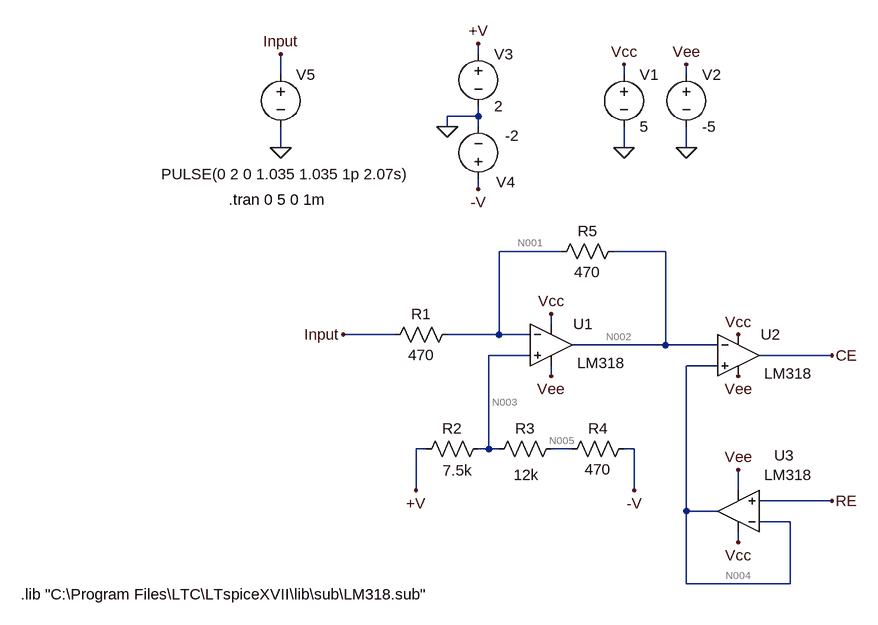
[diagram p0: schematic Offset.asc]
Offset.asc, the LTspice schematic file:
Version 4
SHEET 1 2136 1220
WIRE 256 -144 256 -160
WIRE -48 -112 -48 -144
WIRE 480 -112 480 -128
WIRE 576 -112 576 -128
WIRE 256 -48 256 -64
WIRE 256 -48 208 -48
WIRE 208 -32 208 -48
WIRE 256 -32 256 -48
WIRE -48 0 -48 -32
WIRE 480 0 480 -32
WIRE 576 0 576 -32
WIRE 256 64 256 48
WIRE 384 160 288 160
WIRE 544 160 464 160
WIRE 368 272 368 256
WIRE 128 288 48 288
WIRE 288 288 288 160
WIRE 288 288 208 288
WIRE 336 288 288 288
WIRE 544 304 544 160
WIRE 544 304 400 304
WIRE 624 304 544 304
WIRE 336 320 272 320
WIRE 800 320 688 320
WIRE 624 336 576 336
WIRE 368 352 368 336
WIRE 176 464 160 464
WIRE 272 464 272 320
WIRE 272 464 256 464
WIRE 288 464 272 464
WIRE 400 464 368 464
WIRE 496 464 480 464
WIRE 160 528 160 464
WIRE 496 528 496 464
WIRE 656 528 656 496
WIRE 800 544 688 544
WIRE 576 560 576 336
WIRE 624 560 576 560
WIRE 736 576 688 576
WIRE 656 608 656 592
WIRE 576 672 576 560
WIRE 736 672 736 576
WIRE 736 672 576 672
FLAG 480 -128 Vcc
FLAG 368 256 Vcc
FLAG 368 352 Vee
FLAG 576 -128 Vee
FLAG 256 -160 +V
FLAG 160 528 +V
FLAG 256 64 -V
FLAG 496 528 -V
FLAG -48 -144 Input
FLAG 48 288 Input
FLAG -48 0 0
FLAG 480 0 0
FLAG 576 0 0
FLAG 208 -32 0
FLAG 800 320 CE
FLAG 656 352 Vee
FLAG 656 496 Vee
FLAG 656 288 Vcc
FLAG 656 608 Vcc
FLAG 800 544 RE
SYMBOL res 160 480 R270
WINDOW 0 32 56 VTop 2
WINDOW 3 -33 64 VTop 2
SYMATTR InstName R2
SYMATTR Value 7.5k
SYMBOL res 224 272 R90
WINDOW 0 0 56 VBottom 2
WINDOW 3 32 56 VTop 2
SYMATTR InstName R1
SYMATTR Value 470
SYMBOL res 480 144 R90
WINDOW 0 0 56 VBottom 2
WINDOW 3 32 56 VTop 2
SYMATTR InstName R5
SYMATTR Value 470
SYMBOL OpAmps\\opamp2 368 240 R0
WINDOW 0 34 32 Left 2
WINDOW 3 40 92 Left 2
SYMATTR InstName U1
SYMATTR Value LM318
SYMBOL voltage 480 -128 R0
WINDOW 123 0 0 Left 0
WINDOW 39 0 0 Left 0
SYMATTR InstName V1
SYMATTR Value 5
SYMBOL voltage 576 -128 R0
WINDOW 123 0 0 Left 0
WINDOW 39 0 0 Left 0
SYMATTR InstName V2
SYMATTR Value -5
SYMBOL voltage 256 -160 R0
WINDOW 123 0 0 Left 0
WINDOW 39 0 0 Left 0
SYMATTR InstName V3
SYMATTR Value 2
SYMBOL voltage 256 64 R180
WINDOW 0 -57 11 Left 2
WINDOW 3 -63 82 Left 2
WINDOW 123 0 0 Left 0
WINDOW 39 0 0 Left 0
SYMATTR InstName V4
SYMATTR Value -2
SYMBOL voltage -48 -128 R0
WINDOW 123 0 0 Left 0
WINDOW 39 0 0 Left 0
WINDOW 3 -184 169 Left 2
SYMATTR Value PULSE(0 2 0 1.035 1.035 1p 2.07s)
SYMATTR InstName V5
SYMBOL res 272 480 R270
WINDOW 0 32 56 VTop 2
WINDOW 3 -8 58 VBottom 2
SYMATTR InstName R3
SYMATTR Value 12k
SYMBOL res 496 448 R90
WINDOW 0 0 56 VBottom 2
WINDOW 3 32 56 VTop 2
SYMATTR InstName R4
SYMATTR Value 470
SYMBOL OpAmps\\opamp2 656 256 R0
WINDOW 0 34 32 Left 2
WINDOW 3 40 92 Left 2
SYMATTR InstName U2
SYMATTR Value LM318
SYMBOL OpAmps\\opamp2 656 624 R180
WINDOW 0 -86 150 Left 2
WINDOW 3 -114 120 Left 2
SYMATTR InstName U3
SYMATTR Value LM318
TEXT -448 688 Left 2 !.lib "C:\\Program Files\\LTC\\LTspiceXVII\\lib\\sub\\LM318.sub"
TEXT -128 80 Left 2 !.tran 0 5 0 1m

The netlist it stands for:
* Offset.asc
R2 +V N003 7.5k
R1 N001 Input 470
R5 N002 N001 470
XU1 N003 N001 Vcc Vee N002 LM318  ; pins In+ In- V+ V- OUT
V1 Vcc 0 5
V2 Vee 0 -5
V3 +V 0 2
V4 -V 0 -2
V5 Input 0 PULSE(0 2 0 1.035 1.035 1p 2.07s)
R3 N003 N005 12k
R4 -V N005 470
XU2 N004 N002 Vcc Vee CE LM318  ; pins In+ In- V+ V- OUT
XU3 RE N004 Vcc Vee N004 LM318  ; pins In+ In- V+ V- OUT
.lib "C:\Program Files\LTC\LTspiceXVII\lib\sub\LM318.sub"
.tran 0 5 0 1m
.backanno
.end

* Results of the author's LTspice run, read from the files saved beside the schematic
* Operating Point, zero values left out:
*   V(+v) = 2 V
*   V(n003) = 497 mV
*   V(n001) = 497 mV
*   V(n002) = 994.2 mV
*   V(vee) = -5 V
*   V(vcc) = 5 V
*   V(-v) = -2 V
*   V(n005) = -1.906 V
*   V(ce) = -3.032 V
*   V(n004) = -3.031 V
*   V(re) = -3.977 V
*   I(R4) = -200.2 µA
*   I(R3) = 200.2 µA
*   I(R5) = 1.058 mA
*   I(R1) = 1.058 mA
*   I(R2) = 200.4 µA
*   I(V5) = 1.058 mA
*   I(V4) = 200.2 µA
*   I(V3) = -200.4 µA
*   I(V2) = 5.42 mA
*   I(V1) = -8.451 mA
*   Ix(u1:1) = 149.6 nA
*   Ix(u1:2) = 149.6 nA
*   Ix(u1:3) = 2.828 mA
*   Ix(u1:4) = -2.833 mA
*   Ix(u1:5) = -1.058 mA
*   Ix(u2:1) = -10.63 pA
*   Ix(u2:2) = 299.3 nA
*   Ix(u2:3) = 2.829 mA
*   Ix(u2:4) = -1.278 mA
*   Ix(u2:5) = -628.9 pA
*   Ix(u3:2) = 293.3 nA
*   Ix(u3:3) = 2.794 mA
*   Ix(u3:4) = -1.309 mA
*   Ix(u3:5) = -294.3 nA
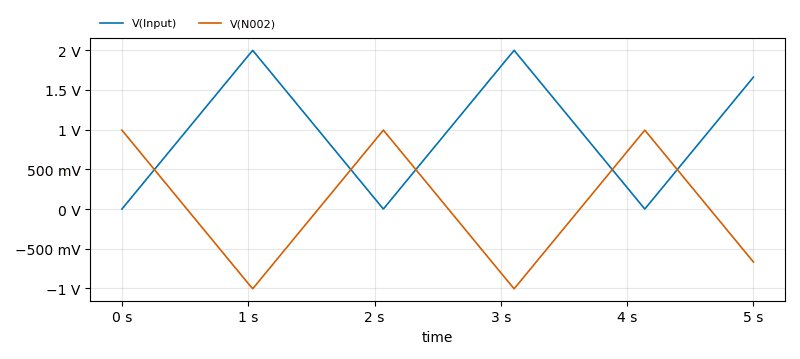
[diagram p1: Transient Analysis of Offset.asc, plotted from the saved traces]
* Transient Analysis, 1 run:
*   V(Input): min 0 V, max 1.999 V, average 970.9 mV, rms 1.347 V, last 1.662 V
*   V(N002): min -1.005 V, max 994.2 mV, average 23.27 mV, rms 933.4 mV, last -667.7 mV